# Altium schematic sheet v1.0.SchDoc
size 66 x 50 mm
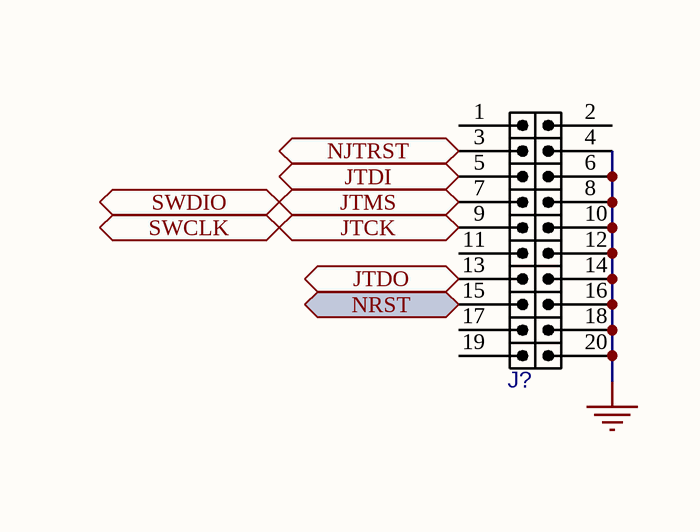
[diagram p0: v1.0.SchDoc]

## Parts
J?  Connector_2x10Pin_Male  [IDC_THD_P2.54_2X10]  (value not drawn)

## Ports
JTCK (bidir), JTDI (bidir), JTDO (bidir), JTMS (bidir), NJTRST (bidir), NRST, SWCLK (bidir), SWDIO (bidir)

## Nets
GND: J?.4 J?.6 J?.8 J?.10 J?.12 J?.14 J?.16 J?.18 J?.20
JTCK: J?.9 ; port JTCK, port SWCLK
JTDI: J?.5 ; port JTDI
JTDO: J?.13 ; port JTDO
JTMS: J?.7 ; port JTMS, port SWDIO
NJTRST: J?.3 ; port NJTRST
NRST: J?.15 ; port NRST

Not connected (* = marked no-connect by the designer): J? 1 2 11 17 19

## Library data of the parts
J? = Connector_2x10Pin_Male: Connector, Header; 1_Part Number: TST-115-04-G-D-RA; 1_Manufacturer: Samtec; 1_Link: https://eu.mouser.com/ProductDetail/Samtec/TST-115-04-G-D-RA?qs=rU5fayqh%252BE1yg%2FuIccJSSw%3D%3D